# Altium schematic sheet Sensors.SchDoc
size 420 x 297 mm; SheetNumber: 6; SheetTotal: 6; Разработчик: Волков; Проверяющий: Андрейчук; Технический_контроль: Ашуркевич; Нормативный_контроль: Василевская; Утвердил: Чвала; Номер_листа: 1; Количество_листов: 4; Организация: МРК; Номер_документа: ТЗСЦ.421457.001Э3; Название_документа: Устройство управления сервоприводами на основе микроконтроллера STM32
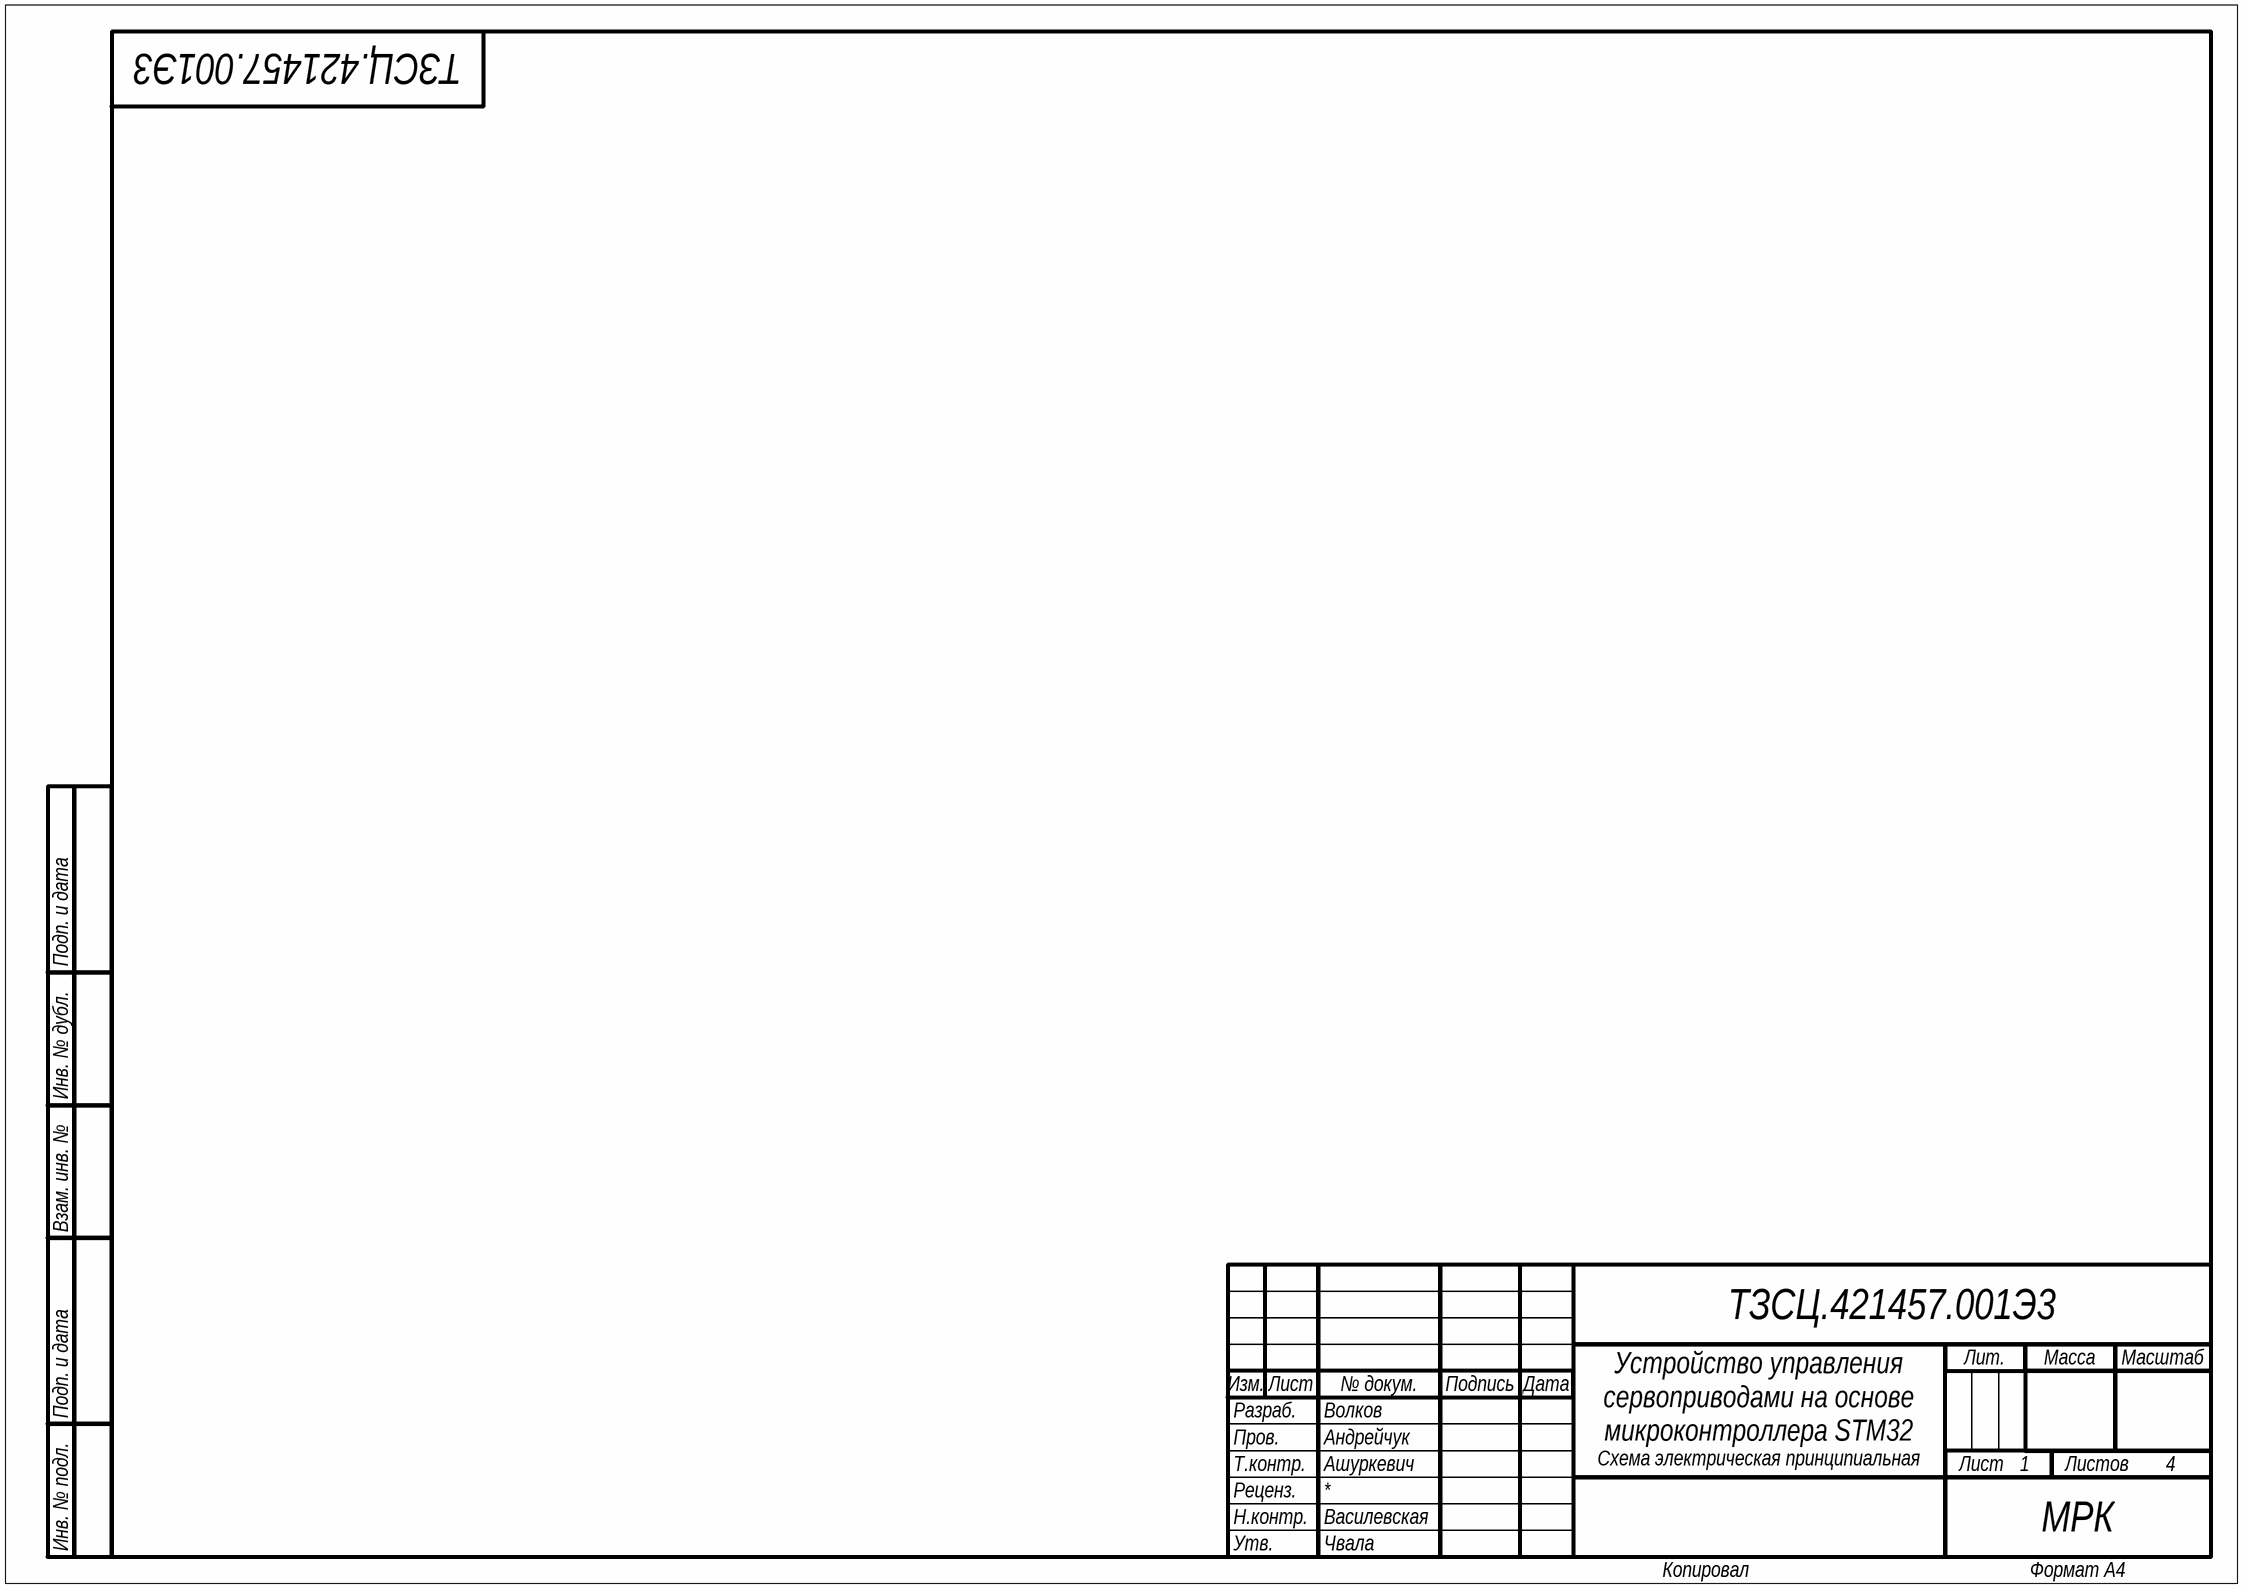
[diagram p0: Sensors.SchDoc]

## Notes on the sheet
- Подп. и дата
- Инв. № дубл.
- Взам. инв. №
- Разраб.
- Изм.
- Лист
- № докум.
- Подпись
- Дата
- Лит.
- Масса
- Масштаб
- Пров.
- Т.контр.
- Схема электрическая принципиальная
- Листов
- Реценз.
- Н.контр.
- Утв.
- Инв. № подл.
- Копировал
- Формат А4